# Altium project PCB_Project1.PrjPCB
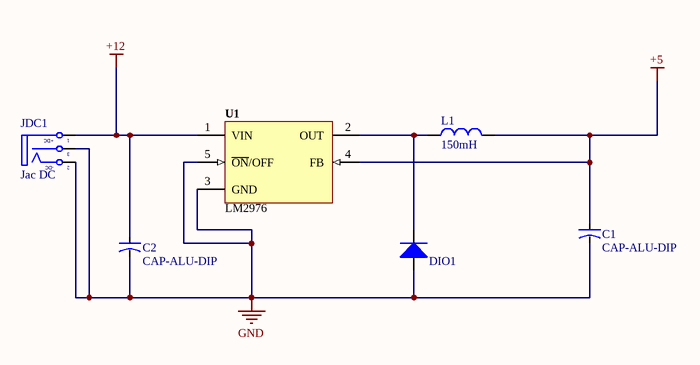
[diagram p0: LM2596.SchDoc]
1 sheet, 6 parts. Net scope: global (net labels, ports and power ports of the same name join across sheets).
Board file: LM2596_PCB.PcbDoc

## Sheet LM2596.SchDoc
size A

### Parts
C1  CAP-ALU-DIP  [CA-ALU-2.54]
C2  CAP-ALU-DIP  [CA-ALU-2.54]
DIO1  Diode SMD  [DIO-SMD-106]  (value not drawn)
JDC1  Jac DC  [DC-IN]
L1  150mH  [L-SMD-M-7.3x4.5]
U1  LM2976  [TO-263]

### Nets
+5: C1.1 L1.2 U1.4(FB)
+12: C2.1 JDC1.1(T) U1.1(VIN)
GND: C1.2 C2.2 DIO1.1(A) JDC1.2(TN) JDC1.3(S) U1.3(GND) U1.5(~{ON}/OFF)
NetDIO1_2: DIO1.2(K) L1.1 U1.2(OUT)

### Notes on the sheet
- (in symbol DCIN) +DC; -DC

### Library data of the parts
C1 C2 = CAP-ALU-DIP: Capacitor (Semiconductor SIM Model); Value: 104; LatestRevisionDate: 17-Jul-2002; LatestRevisionNote: Re-released for DXP Platform.; PackageReference: C1206; Publisher: Altium Limited
DIO1 = Diode SMD: Default Diode; Code - JEDEC: DO-214-AB; Value: 1N5007; Published: 8-Jun-2000; Revision: July-2002: Re-released for DXP Platform.; Publisher: Altium Limited
JDC1 = DCIN: Jac DC input; Value: Jac DC
L1 = Inductor: Value: 150 mH
U1 = LM2596: Max Input Voltage: 12 V; Max Output Current: 3 (6.0 peak) A; Max Output Voltage: mV; Category: IC-Power; Min Input Voltage: mV; Min Output Voltage: mV; Mounting Technology: Surface Mount; Status: Unreleased; Supply Voltage: mV; Temperature Range: -40 to +125 degC